# Altium schematic sheet CPU ROM.SchDoc
size A4
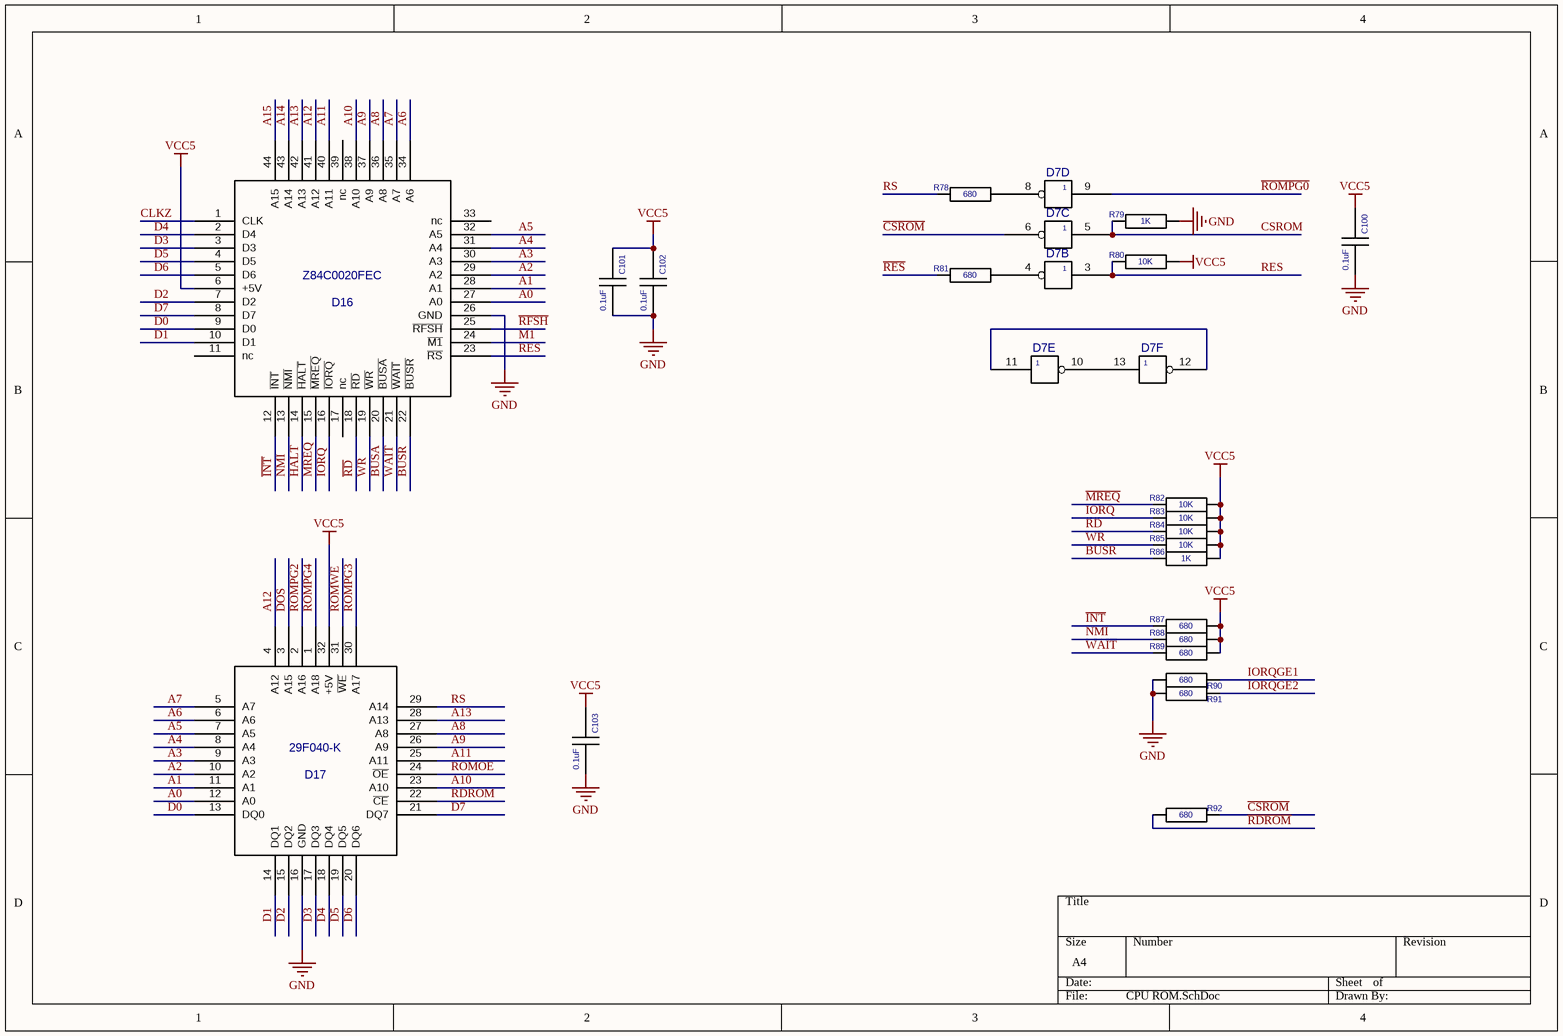
[diagram p0: CPU ROM.SchDoc]

## Parts
C100  value 0.1uF  [C-CHIP]  (hidden comment: CAPCHIP)
C101  value 0.1uF  [C-CHIP]  (hidden comment: CAPCHIP)
C102  value 0.1uF  [C-CHIP]  (hidden comment: CAPCHIP)
C103  value 0.1uF  [C-CHIP]  (hidden comment: CAPCHIP)
D7  04  [SO14]  (value not drawn)  (parts B,C,D,E,F of 6)
D16  Z84C0020FEC  [QFP44X8]
D17  29F040-K  [PLCC32]
R78  value 680  [R-CHIP]  (hidden comment: RESCHIP)
R79  value 1K  [R-CHIP]  (hidden comment: RESCHIP)
R80  value 10K  [R-CHIP]  (hidden comment: RESCHIP)
R81  value 680  [R-CHIP]  (hidden comment: RESCHIP)
R82  value 10K  [R-CHIP]  (hidden comment: RESCHIP)
R83  value 10K  [R-CHIP]  (hidden comment: RESCHIP)
R84  value 10K  [R-CHIP]  (hidden comment: RESCHIP)
R85  value 10K  [R-CHIP]  (hidden comment: RESCHIP)
R86  value 1K  [R-CHIP]  (hidden comment: RESCHIP)
R87  value 680  [R-CHIP]  (hidden comment: RESCHIP)
R88  value 680  [R-CHIP]  (hidden comment: RESCHIP)
R89  value 680  [R-CHIP]  (hidden comment: RESCHIP)
R90  value 680  [R-CHIP]  (hidden comment: RESCHIP)
R91  value 680  [R-CHIP]  (hidden comment: RESCHIP)
R92  value 680  [R-CHIP]  (hidden comment: RESCHIP)

## Nets
GND: C100.2 C101.2 C102.2 C103.2 D7.7(GND) D16.26(GND) D17.16(GND) R79.1(i/o) R90.1(i/o) R91.1(i/o)
VCC5: C100.1 C101.1 C102.1 C103.1 D7.14(+5v) D16.6(+5V) D17.32(+5V) R80.1(i/o) R82.1(i/o) R83.1(i/o) R84.1(i/o) R85.1(i/o) R86.1(i/o) R87.1(i/o) R88.1(i/o) R89.1(i/o)
A0: D16.27(A0) D17.12(A0)
A1: D16.28(A1) D17.11(A1)
A2: D16.29(A2) D17.10(A2)
A3: D16.30(A3) D17.9(A3)
A4: D16.31(A4) D17.8(A4)
A5: D16.32(A5) D17.7(A5)
A6: D16.34(A6) D17.6(A6)
A7: D16.35(A7) D17.5(A7)
A8: D16.36(A8) D17.27(A8)
A9: D16.37(A9) D17.26(A9)
A10: D16.38(A10) D17.23(A10)
A11: D16.40(A11) D17.25(A11)
A12: D16.41(A12) D17.4(A12)
A13: D16.42(A13) D17.28(A13)
A14: D16.43(A14)
A15: D16.44(A15)
~{BUSA}: D16.20(~{BUSA})
~{BUSR}: D16.22(~{BUSR}) R86.2(i/o1)
~{CSROM}: D7.6 R92.2(i/o1)
CLKZ: D16.1(CLK)
CSROM: D7.5 R79.2(i/o1)
D0: D16.9(D0) D17.13(DQ0)
D1: D16.10(D1) D17.14(DQ1)
D2: D16.7(D2) D17.15(DQ2)
D3: D16.3(D3) D17.17(DQ3)
D4: D16.2(D4) D17.18(DQ4)
D5: D16.4(D5) D17.19(DQ5)
D6: D16.5(D6) D17.20(DQ6)
D7: D16.8(D7) D17.21(DQ7)
~{DOS}: D17.3(A15)
~{HALT}: D16.14(~{HALT})
~{INT}: D16.12(~{INT}) R87.2(i/o1)
~{IORQ}: D16.16(~{IORQ}) R83.2(i/o1)
IORQGE1: R90.2(i/o1)
IORQGE2: R91.2(i/o1)
~{M1}: D16.24(~{M1})
~{MREQ}: D16.15(~{MREQ}) R82.2(i/o1)
~{NMI}: D16.13(~{NMI}) R88.2(i/o1)
~{RD}: D16.18(~{RD}) R84.2(i/o1)
~{RDROM}: D17.22(~{CE}) R92.1(i/o)
~{RES}: D16.23(~{RS}) R81.2(i/o1)
~{RFSH}: D16.25(~{RFSH})
~{ROMOE}: D17.24(~{OE})
~{ROMPG0}: D7.9
~{ROMWE}: D17.31(~{WE})
RES: D7.3 R80.2(i/o1)
ROMPG2: D17.2(A16)
ROMPG3: D17.30(A17)
ROMPG4: D17.1(A18)
RS: D17.29(A14) R78.2(i/o1)
~{WAIT}: D16.21(~{WAIT}) R89.2(i/o1)
~{WR}: D16.19(~{WR}) R85.2(i/o1)
NetD7_4: D7.4 R81.1(i/o)
NetD7_8: D7.8 R78.1(i/o)
NetD7_10: D7.10 D7.13
NetD7_11: D7.11 D7.12

Not connected (* = marked no-connect by the designer): D16 11(nc) 17(nc) 33(nc) 39(nc)

## Library data of the parts
D7 = 04: Value: 74ACT04
D16 = Z84C0020FEC: Value: *
D17 = 29F040-K: Value: *